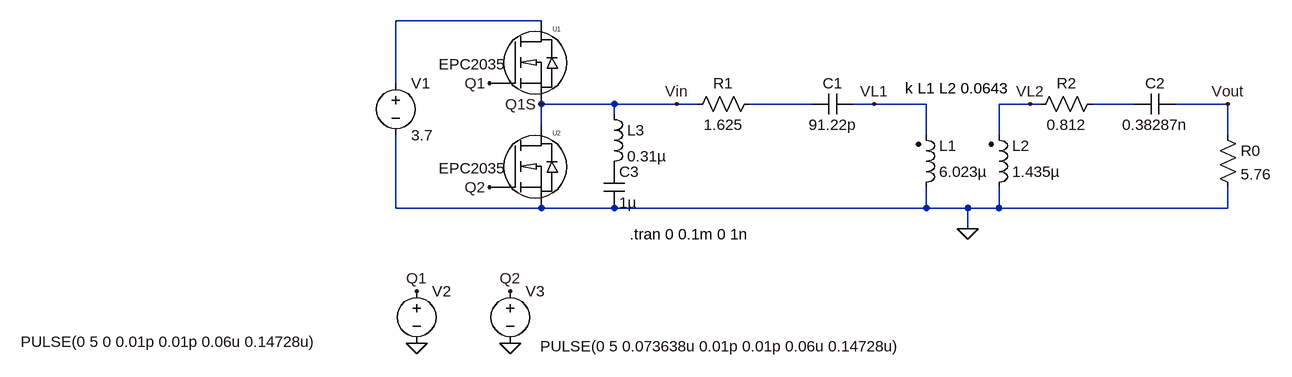
[diagram p0: schematic WPT_Coupled_Inv_ZVS.asc]
WPT_Coupled_Inv_ZVS.asc, the LTspice schematic file:
Version 4
SHEET 1 2368 796
WIRE -208 -16 -432 -16
WIRE -432 80 -432 -16
WIRE -96 112 -208 112
WIRE 0 112 -96 112
WIRE 32 112 0 112
WIRE 208 112 112 112
WIRE 304 112 272 112
WIRE 384 112 304 112
WIRE 544 112 496 112
WIRE 560 112 544 112
WIRE 704 112 640 112
WIRE 848 112 768 112
WIRE -96 128 -96 112
WIRE -208 144 -208 112
WIRE 384 160 384 112
WIRE 496 160 496 112
WIRE 848 160 848 112
WIRE -432 272 -432 160
WIRE -208 272 -432 272
WIRE -96 272 -208 272
WIRE 384 272 384 240
WIRE 384 272 -96 272
WIRE 448 272 384 272
WIRE 496 272 496 240
WIRE 496 272 448 272
WIRE 848 272 848 240
WIRE 848 272 496 272
WIRE 448 304 448 272
FLAG 448 304 0
FLAG 0 112 Vin
FLAG 848 112 Vout
FLAG 304 112 VL1
FLAG 544 112 VL2
FLAG -288 80 Q1
FLAG -288 240 Q2
FLAG -256 480 0
FLAG -400 400 Q1
FLAG -256 400 Q2
FLAG -208 112 Q1S
FLAG -400 480 0
SYMBOL cap 272 96 R90
WINDOW 0 0 32 VBottom 2
WINDOW 3 32 32 VTop 2
SYMATTR InstName C1
SYMATTR Value 91.22p
SYMBOL ind2 368 256 M180
WINDOW 0 36 80 Left 2
WINDOW 3 36 40 Left 2
SYMATTR InstName L1
SYMATTR Value 6.023µ
SYMATTR Type ind
SYMBOL ind2 480 256 M180
WINDOW 0 36 80 Left 2
WINDOW 3 36 40 Left 2
SYMATTR InstName L2
SYMATTR Value 1.435µ
SYMATTR Type ind
SYMBOL res 128 96 R90
WINDOW 0 0 56 VBottom 2
WINDOW 3 32 56 VTop 2
SYMATTR InstName R1
SYMATTR Value 1.625
SYMBOL res 656 96 R90
WINDOW 0 0 56 VBottom 2
WINDOW 3 32 56 VTop 2
SYMATTR InstName R2
SYMATTR Value 0.812
SYMBOL cap 768 96 R90
WINDOW 0 0 32 VBottom 2
WINDOW 3 32 32 VTop 2
SYMATTR InstName C2
SYMATTR Value 0.38287n
SYMBOL res 832 144 R0
SYMATTR InstName R0
SYMATTR Value 5.76
SYMBOL voltage -400 384 R0
WINDOW 123 0 0 Left 0
WINDOW 39 0 0 Left 0
WINDOW 3 -609 94 Left 2
SYMATTR Value PULSE(0 5 0 0.01p 0.01p 0.06u 0.14728u)
SYMATTR InstName V2
SYMBOL EPCGaN -288 80 R0
WINDOW 3 -78 -29 Left 2
SYMATTR Value EPC2035
SYMATTR InstName U1
SYMBOL EPCGaN -288 240 R0
WINDOW 3 -78 -29 Left 2
SYMATTR Value EPC2035
SYMATTR InstName U2
SYMBOL voltage -432 64 R0
WINDOW 123 0 0 Left 0
WINDOW 39 0 0 Left 0
SYMATTR InstName V1
SYMATTR Value 3.7
SYMBOL voltage -256 384 R0
WINDOW 123 0 0 Left 0
WINDOW 39 0 0 Left 0
WINDOW 3 46 101 Left 2
SYMATTR Value PULSE(0 5 0.073638u 0.01p 0.01p 0.06u 0.14728u)
SYMATTR InstName V3
SYMBOL cap -112 208 R0
SYMATTR InstName C3
SYMATTR Value 1µ
SYMBOL ind -112 112 R0
SYMATTR InstName L3
SYMATTR Value 0.31µ
TEXT 352 88 Left 2 !k L1 L2 0.0643
TEXT -72 312 Left 2 !.tran 0 0.1m 0 1n

The netlist it stands for:
* WPT_Coupled_Inv_ZVS.asc
C1 VL1 N002 91.22p
L1 0 VL1 6.023µ
L2 0 VL2 1.435µ
R1 N002 Q1S 1.625
R2 N003 VL2 0.812
C2 Vout N003 0.38287n
R0 Vout 0 5.76
V2 Q1 0 PULSE(0 5 0 0.01p 0.01p 0.06u 0.14728u)
XU1 Q1 N001 Q1S EPC2035  ; pins gatein drainin N_0
XU2 Q2 Q1S 0 EPC2035  ; pins gatein drainin N_0
V1 N001 0 3.7
V3 Q2 0 PULSE(0 5 0.073638u 0.01p 0.01p 0.06u 0.14728u)
C3 P001 0 1µ
L3 Q1S P001 0.31µ
k L1 L2 0.0643
.tran 0 0.1m 0 1n
.lib EPCGanlibrary.lib
.backanno
.end